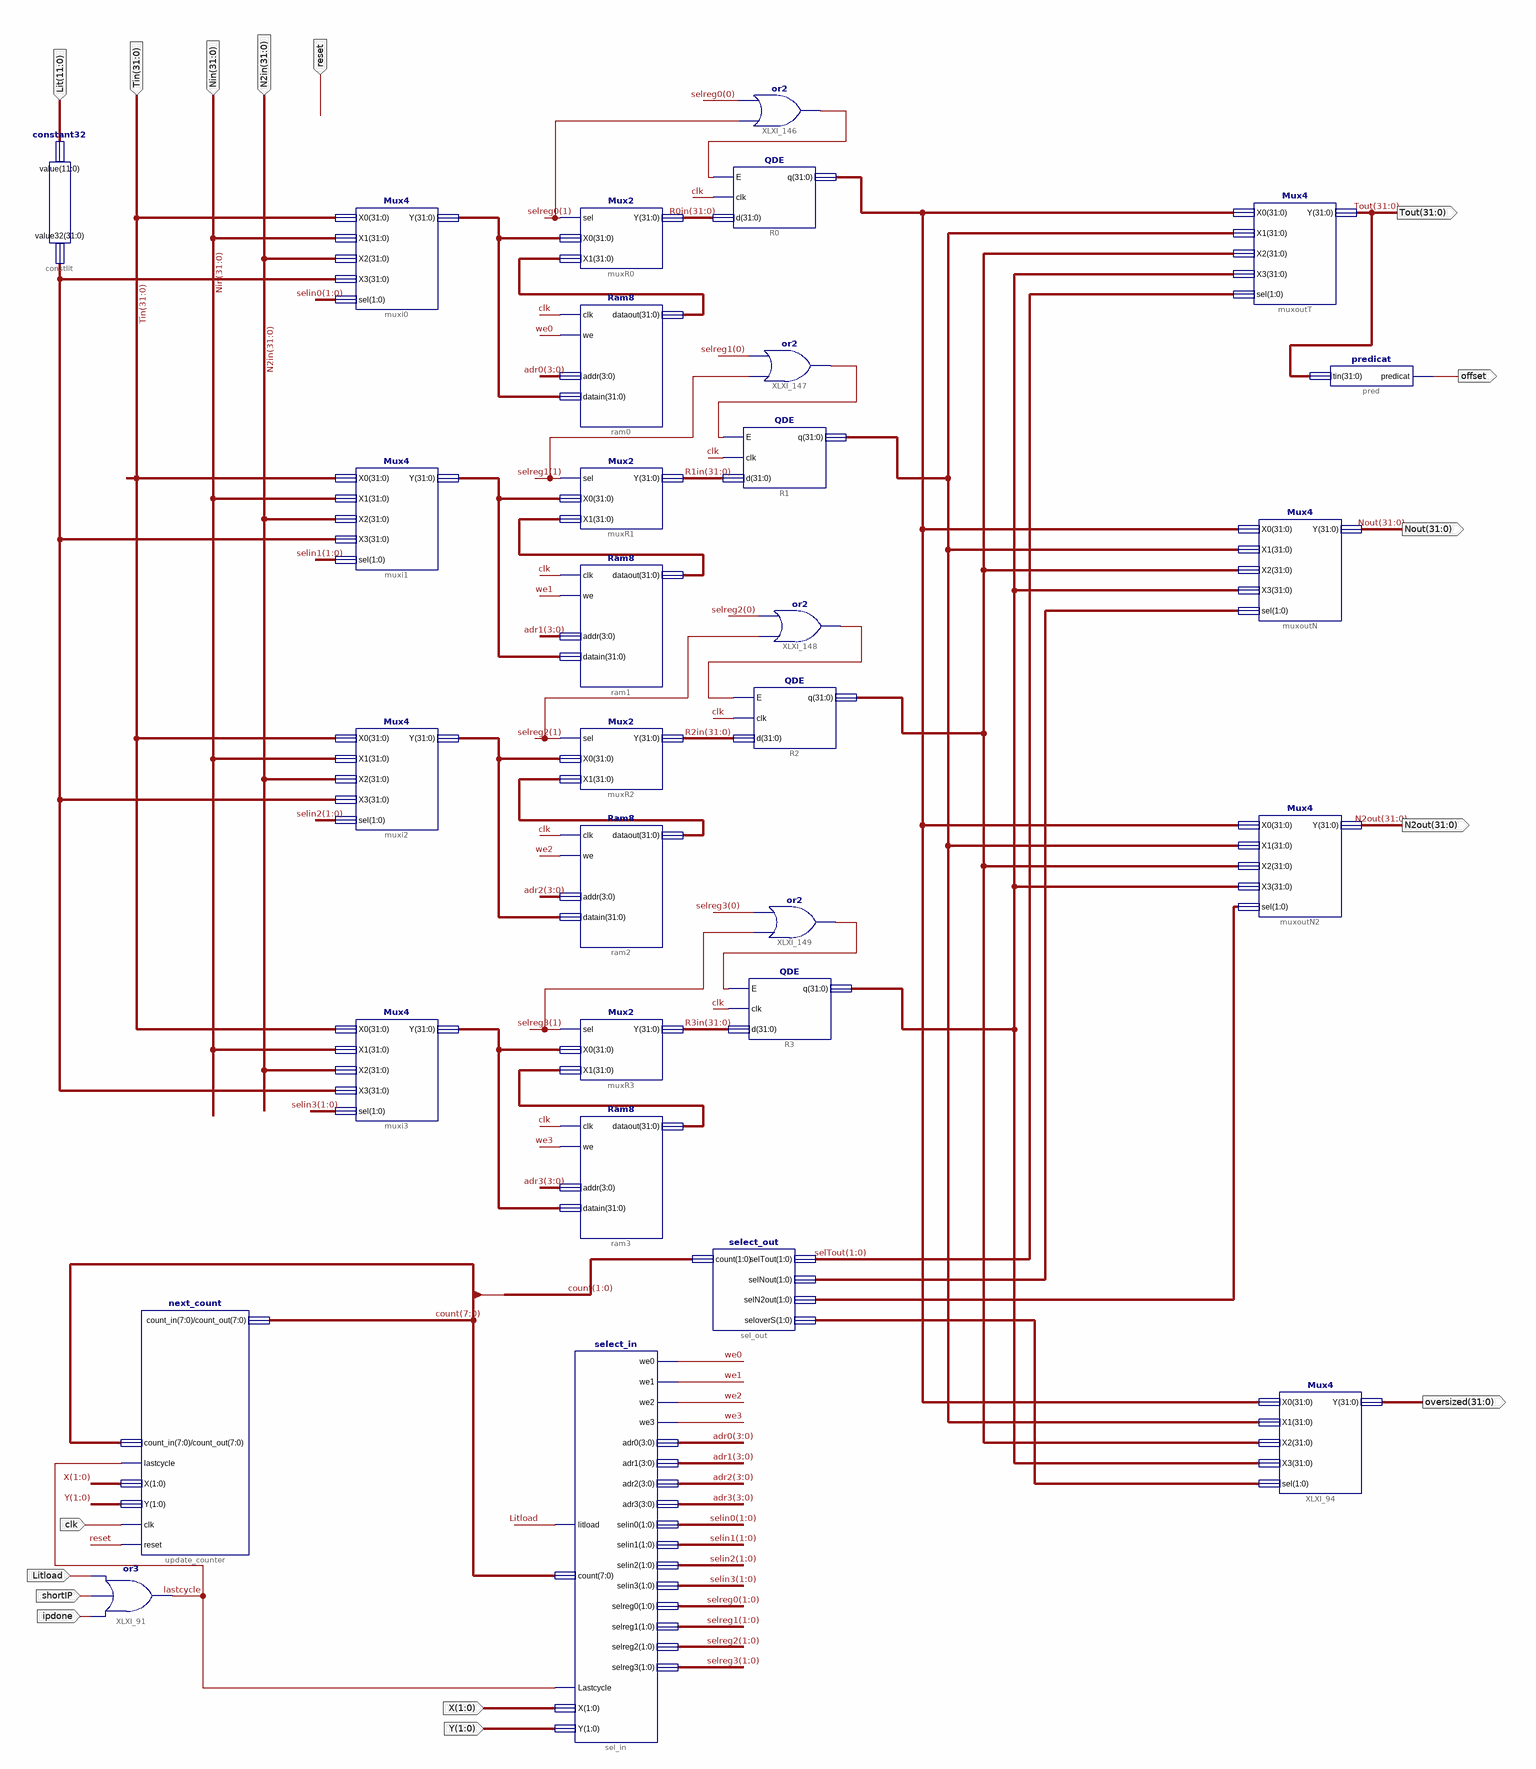
[diagram p0: schematic sheet 1]
// Xilinx ISE schematic Hstack.sch (spartan6) as structural Verilog: 30 symbols, 16 ports
module Hstack (
  input  [31:0] Nin,
  input  [31:0] N2in,
  input  clk,
  input  reset,
  input  Litload,
  input  [31:0] Tin,
  input  [11:0] Lit,
  input  ipdone,
  input  shortIP,
  input  [1:0] X,
  input  [1:0] Y,
  output [31:0] Tout,
  output [31:0] Nout,
  output [31:0] N2out,
  output [31:0] oversized,
  output offset
);

  wire lastcycle, we0, we1, we2, we3, XLXN_332, XLXN_338, XLXN_340, XLXN_342;
  wire [1:0] selin0, selin1, selin2, selin3, selreg0, selreg1, selreg2, selreg3, selTout, XLXN_82, XLXN_83,
       XLXN_223;
  wire [3:0] adr0, adr1, adr2, adr3;
  wire [7:0] count;
  wire [31:0] R0in, R1in, R2in, R3in, XLXN_17, XLXN_26, XLXN_34, XLXN_39, XLXN_41, XLXN_46, XLXN_48, XLXN_53,
       XLXN_225, XLXN_226, XLXN_227, XLXN_259, XLXN_269;

  Ram8 ram0 (.clk(clk), .we(we0), .addr(adr0), .datain(XLXN_26), .dataout(XLXN_17));
  Ram8 ram1 (.clk(clk), .we(we1), .addr(adr1), .datain(XLXN_39), .dataout(XLXN_34));
  Ram8 ram3 (.clk(clk), .we(we3), .addr(adr3), .datain(XLXN_53), .dataout(XLXN_48));
  Mux4 muxoutT (.X0(XLXN_259), .X1(XLXN_225), .X2(XLXN_226), .X3(XLXN_227), .sel(selTout), .Y(Tout));
  Mux4 muxoutN (.X0(XLXN_259), .X1(XLXN_225), .X2(XLXN_226), .X3(XLXN_227), .sel(XLXN_82), .Y(Nout));
  Mux4 muxoutN2 (.X0(XLXN_259), .X1(XLXN_225), .X2(XLXN_226), .X3(XLXN_227), .sel(XLXN_83), .Y(N2out));
  select_in sel_in (
    .Lastcycle(lastcycle), .litload(Litload), .count(count), .X(X), .Y(Y), .we0(we0), .we1(we1), .we2(we2),
    .we3(we3), .adr0(adr0), .adr1(adr1), .adr2(adr2), .adr3(adr3), .selin0(selin0), .selin1(selin1),
    .selin2(selin2), .selin3(selin3), .selreg0(selreg0), .selreg1(selreg1), .selreg2(selreg2),
    .selreg3(selreg3));
  next_count update_counter (
    .lastcycle(lastcycle), .clk(clk), .count_in(count), .X(X), .Y(Y), .count_out(count), .reset(reset));
  select_out sel_out (
    .count(count[1:0]), .selTout(selTout), .selNout(XLXN_82), .selN2out(XLXN_83), .seloverS(XLXN_223));
  constant32 constlit (.value(Lit), .value32(XLXN_269));
  or XLXI_91 (lastcycle, ipdone, shortIP, Litload);
  Mux4 XLXI_94 (.X0(XLXN_259), .X1(XLXN_225), .X2(XLXN_226), .X3(XLXN_227), .sel(XLXN_223), .Y(oversized));
  Mux4 muxi0 (.X0(Tin), .X1(Nin), .X2(N2in), .X3(XLXN_269), .sel(selin0), .Y(XLXN_26));
  Mux4 muxi1 (.X0(Tin), .X1(Nin), .X2(N2in), .X3(XLXN_269), .sel(selin1), .Y(XLXN_39));
  Mux4 muxi3 (.X0(Tin), .X1(Nin), .X2(N2in), .X3(XLXN_269), .sel(selin3), .Y(XLXN_53));
  predicat pred (.tin(Tout), .predicat(offset));
  QDE R0 (.E(XLXN_332), .clk(clk), .d(R0in), .q(XLXN_259));
  QDE R1 (.E(XLXN_338), .clk(clk), .d(R1in), .q(XLXN_225));
  QDE R3 (.E(XLXN_342), .clk(clk), .d(R3in), .q(XLXN_227));
  Mux4 muxi2 (.X0(Tin), .X1(Nin), .X2(N2in), .X3(XLXN_269), .sel(selin2), .Y(XLXN_46));
  Ram8 ram2 (.clk(clk), .we(we2), .addr(adr2), .datain(XLXN_46), .dataout(XLXN_41));
  QDE R2 (.E(XLXN_340), .clk(clk), .d(R2in), .q(XLXN_226));
  Mux2 muxR0 (.sel(selreg0[1]), .X0(XLXN_26), .X1(XLXN_17), .Y(R0in));
  Mux2 muxR1 (.sel(selreg1[1]), .X0(XLXN_39), .X1(XLXN_34), .Y(R1in));
  Mux2 muxR2 (.sel(selreg2[1]), .X0(XLXN_46), .X1(XLXN_41), .Y(R2in));
  Mux2 muxR3 (.sel(selreg3[1]), .X0(XLXN_53), .X1(XLXN_48), .Y(R3in));
  or XLXI_146 (XLXN_332, selreg0[1], selreg0[0]);
  or XLXI_147 (XLXN_338, selreg1[1], selreg1[0]);
  or XLXI_148 (XLXN_340, selreg2[1], selreg2[0]);
  or XLXI_149 (XLXN_342, selreg3[1], selreg3[0]);

  // Notes on the sheet:
  //   clock_signal on signal clk = yes
endmodule
